# Altium schematic sheet SOM.SchDoc
size A3
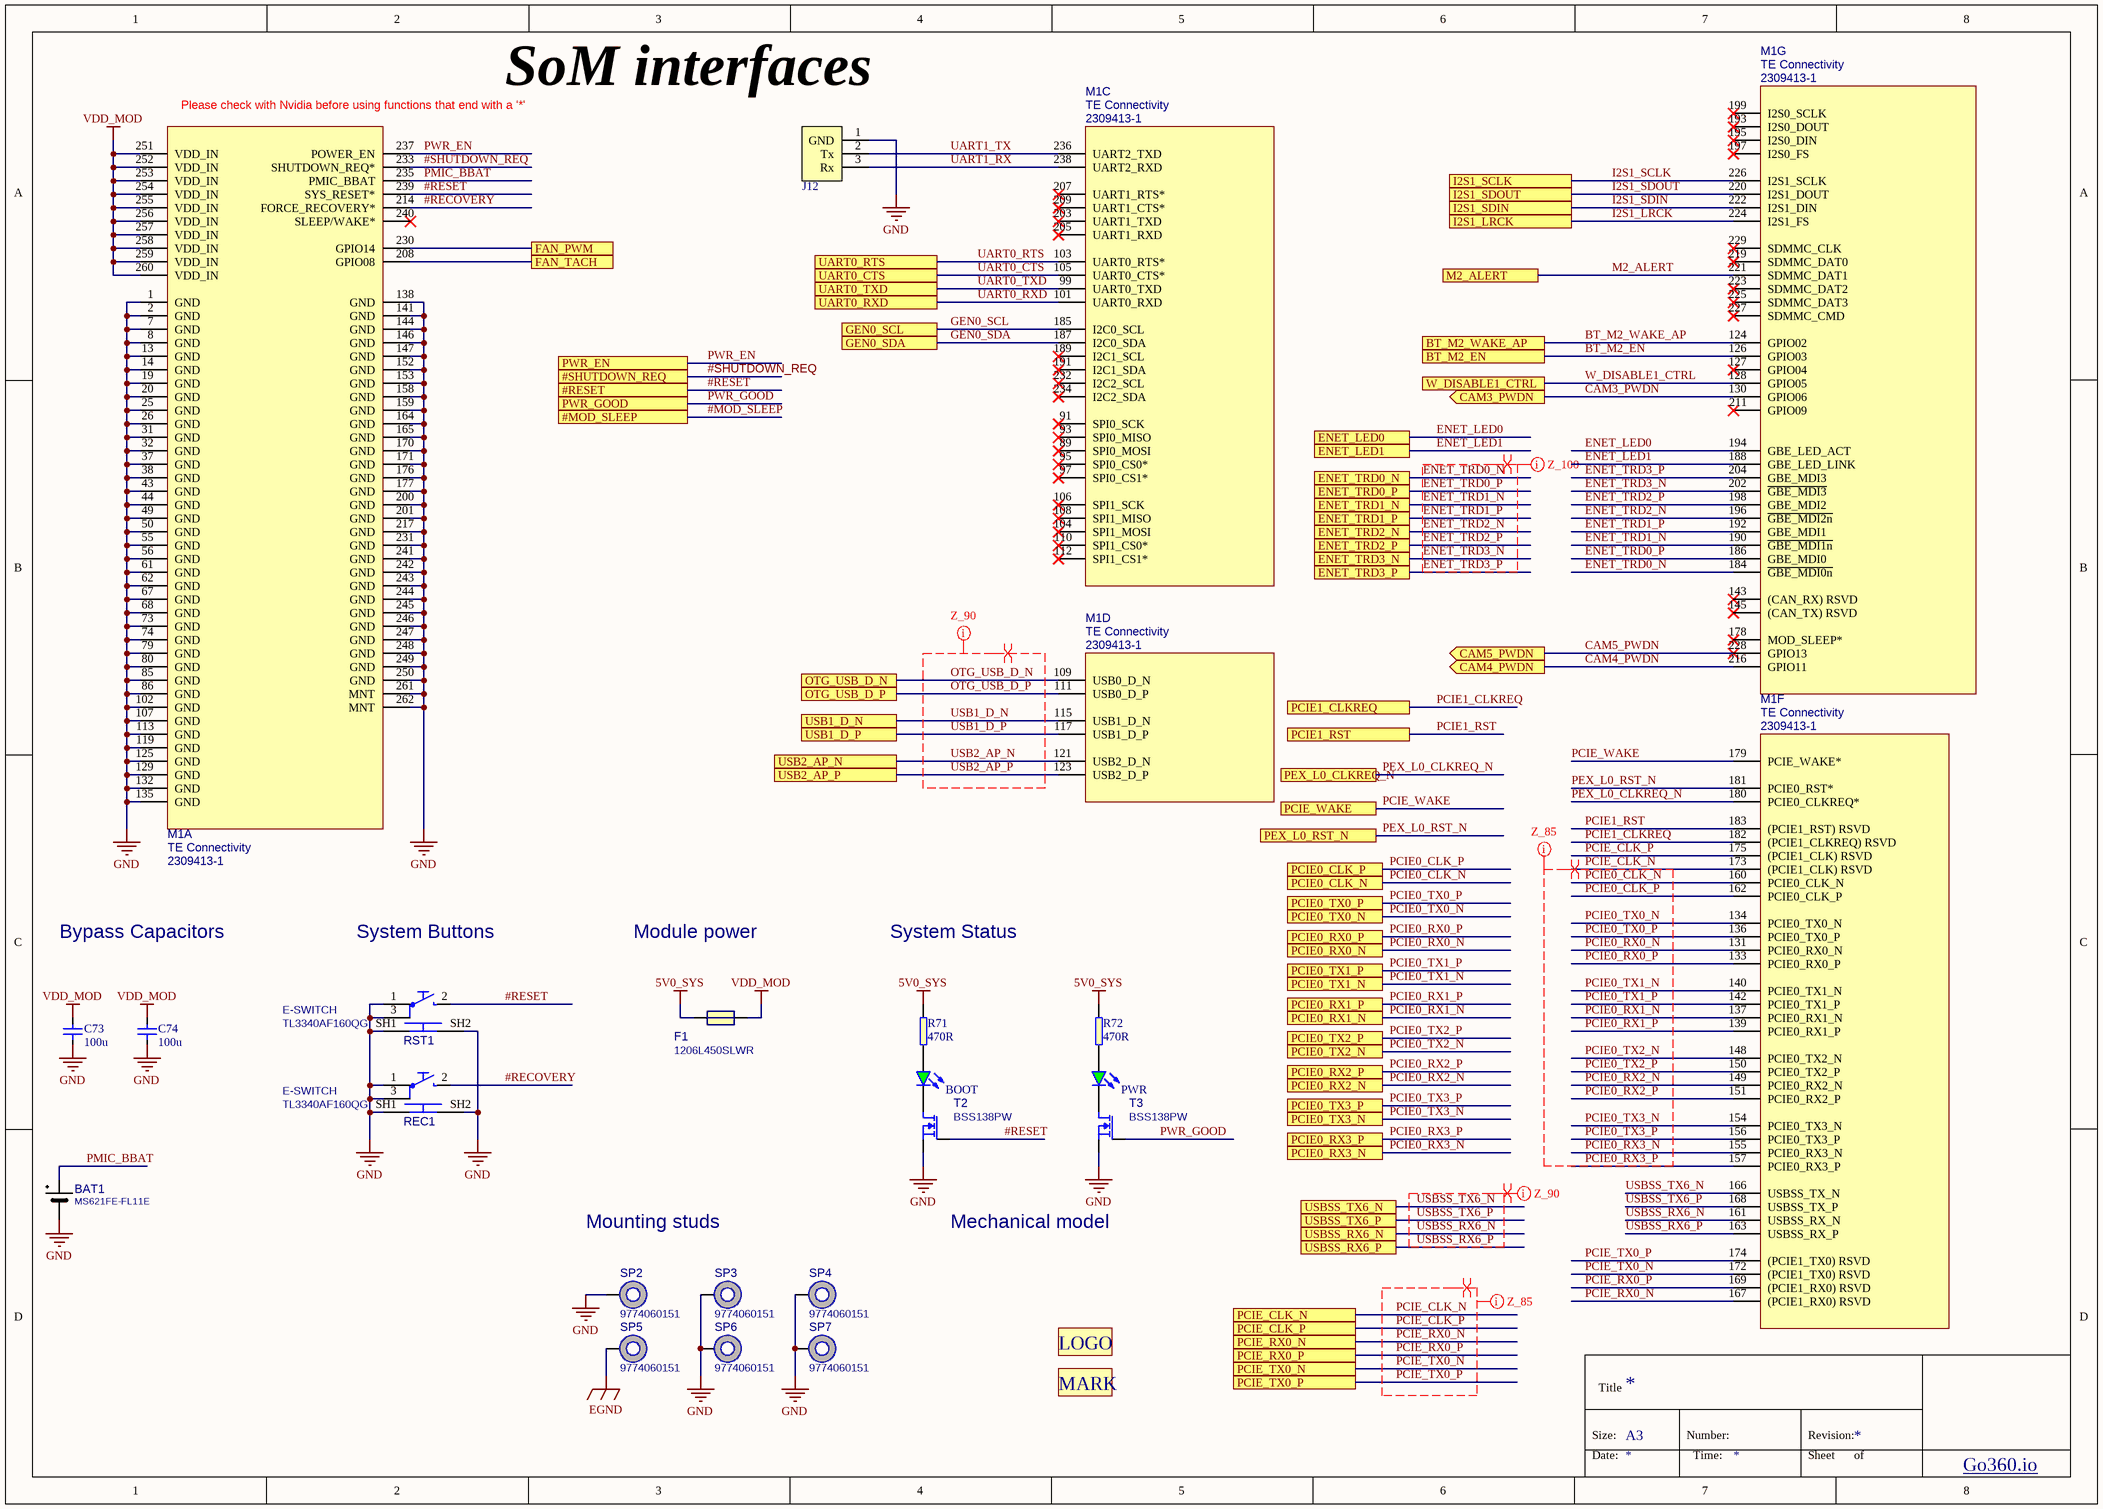
[diagram p0: SOM.SchDoc]

## Parts
BAT1  MS621FE-FL11E  [MS621FE-FL11E]
BOOT  SML-310MTT86  [LED0603]  (value not drawn)
C73  100u  [1206]
C74  100u  [1206]
F1  PartSymbol: 1206L450SLWR  [Fuse-1206]  (hidden comment: Value)
J12  HEADER_3  [826936-3]  (value not drawn)
LOGO1  LOGO  [LOGO_2]  (value not drawn)
M1  Manufacturer: TE Connectivity  [jetson-nano-connector]  (hidden comment: 2309413-1)  (parts A,C,D,F,G of 7)
MARK1  MARK  [MARK]  (value not drawn)
PWR  SML-310MTT86  [LED0603]  (value not drawn)
R71  470R  [R0402]
R72  470R  [R0402]
REC1  Manufacturer: E-SWITCH  [TL3340AF160QG]  (hidden comment: TL3340AF160QG)
RST1  Manufacturer: E-SWITCH  [TL3340AF160QG]  (hidden comment: TL3340AF160QG)
SP2  9774060151  [M2.5-6mm]
SP3  9774060151  [M2.5-6mm]
SP4  9774060151  [M2.5-6mm]
SP5  9774060151  [M2.5-6mm]
SP6  9774060151  [M2.5-6mm]
SP7  9774060151  [M2.5-6mm]
T2  BSS138PW  [SC70-3]
T3  BSS138PW  [SC70-3]

## Ports
#MOD_SLEEP, #RESET, #SHUTDOWN_REQ, BT_M2_EN, BT_M2_WAKE_AP, CAM3_PWDN (out), CAM4_PWDN (out), CAM5_PWDN (out), ENET_LED0, ENET_LED1, ENET_TRD0_N, ENET_TRD0_P, ENET_TRD1_N, ENET_TRD1_P, ENET_TRD2_N, ENET_TRD2_P, ENET_TRD3_N, ENET_TRD3_P, FAN_PWM, FAN_TACH, GEN0_SCL, GEN0_SDA, I2S1_LRCK, I2S1_SCLK, I2S1_SDIN, I2S1_SDOUT, M2_ALERT, OTG_USB_D_N, OTG_USB_D_P, PCIE0_CLK_N, PCIE0_CLK_P, PCIE0_RX0_N, PCIE0_RX0_P, PCIE0_RX1_N, PCIE0_RX1_P, PCIE0_RX2_N, PCIE0_RX2_P, PCIE0_RX3_N, PCIE0_RX3_P, PCIE0_TX0_N, PCIE0_TX0_P, PCIE0_TX1_N, PCIE0_TX1_P, PCIE0_TX2_N, PCIE0_TX2_P, PCIE0_TX3_N, PCIE0_TX3_P, PCIE1_CLKREQ, PCIE1_RST, PCIE_CLK_N, PCIE_CLK_P, PCIE_RX0_N, PCIE_RX0_P, PCIE_TX0_N, PCIE_TX0_P, PCIE_WAKE, PEX_L0_CLKREQ_N, PEX_L0_RST_N, PWR_EN, PWR_GOOD, UART0_CTS, UART0_RTS, UART0_RXD, UART0_TXD, USB1_D_N, USB1_D_P, USB2_AP_N, USB2_AP_P, USBSS_RX6_N, USBSS_RX6_P, USBSS_TX6_N, USBSS_TX6_P, W_DISABLE1_CTRL

## Nets
5V0_SYS: F1.1 R71.2 R72.2
EGND: SP5.1
GND: BAT1.- C73.1 C74.1 J12.1(GND) M1.1(GND) M1.2(GND) M1.7(GND) M1.8(GND) M1.13(GND) M1.14(GND) M1.19(GND) M1.20(GND) M1.25(GND) M1.26(GND) M1.31(GND) M1.32(GND) M1.37(GND) M1.38(GND) M1.43(GND) M1.44(GND) M1.49(GND) M1.50(GND) M1.55(GND) M1.56(GND) M1.61(GND) M1.62(GND) M1.67(GND) M1.68(GND) M1.73(GND) M1.74(GND) M1.79(GND) M1.80(GND) M1.85(GND) M1.86(GND) M1.102(GND) M1.107(GND) M1.113(GND) M1.119(GND) M1.125(GND) M1.129(GND) M1.132(GND) M1.135(GND) M1.138(GND) M1.141(GND) M1.144(GND) M1.146(GND) M1.147(GND) M1.152(GND) M1.153(GND) M1.158(GND) M1.159(GND) M1.164(GND) M1.165(GND) M1.170(GND) M1.171(GND) M1.176(GND) M1.177(GND) M1.200(GND) M1.201(GND) M1.217(GND) M1.231(GND) M1.241(GND) M1.242(GND) M1.243(GND) M1.244(GND) M1.245(GND) M1.246(GND) M1.247(GND) M1.248(GND) M1.249(GND) M1.250(GND) M1.261(MNT) M1.262(MNT) REC1.1 REC1.3 REC1.SH1 REC1.SH2 RST1.1 RST1.3 RST1.SH1 RST1.SH2 SP2.1 SP3.1 SP4.1 SP6.1 SP7.1 T2.2(S) T3.2(S)
VDD_MOD: C73.2 C74.2 F1.2 M1.251(VDD_IN) M1.252(VDD_IN) M1.253(VDD_IN) M1.254(VDD_IN) M1.255(VDD_IN) M1.256(VDD_IN) M1.257(VDD_IN) M1.258(VDD_IN) M1.259(VDD_IN) M1.260(VDD_IN)
#MOD_SLEEP: port #MOD_SLEEP
#RECOVERY: M1.214(FORCE_RECOVERY*) REC1.2
#RESET: M1.239(SYS_RESET*) RST1.2 T2.1(G) ; port #RESET
#SHUTDOWN_REQ: M1.233(SHUTDOWN_REQ*) ; port #SHUTDOWN_REQ
BT_M2_EN: M1.126(GPIO03) ; port BT_M2_EN
BT_M2_WAKE_AP: M1.124(GPIO02) ; port BT_M2_WAKE_AP
CAM3_PWDN: M1.130(GPIO06) ; port CAM3_PWDN
CAM4_PWDN: M1.216(GPIO11) ; port CAM4_PWDN
CAM5_PWDN: M1.228(GPIO13) ; port CAM5_PWDN
ENET_LED0: M1.194(GBE_LED_ACT) ; port ENET_LED0
ENET_LED1: M1.188(GBE_LED_LINK) ; port ENET_LED1
ENET_TRD0_N: M1.184(~{GBE_MDI0n}) ; port ENET_TRD0_N
ENET_TRD0_P: M1.186(GBE_MDI0) ; port ENET_TRD0_P
ENET_TRD1_N: M1.190(~{GBE_MDI1n}) ; port ENET_TRD1_N
ENET_TRD1_P: M1.192(GBE_MDI1) ; port ENET_TRD1_P
ENET_TRD2_N: M1.196(~{GBE_MDI2n}) ; port ENET_TRD2_N
ENET_TRD2_P: M1.198(GBE_MDI2) ; port ENET_TRD2_P
ENET_TRD3_N: M1.202(~{GBE_MDI3}) ; port ENET_TRD3_N
ENET_TRD3_P: M1.204(GBE_MDI3) ; port ENET_TRD3_P
FAN_PWM: M1.230(GPIO14) ; port FAN_PWM
FAN_TACH: M1.208(GPIO08) ; port FAN_TACH
GEN0_SCL: M1.185(I2C0_SCL) ; port GEN0_SCL
GEN0_SDA: M1.187(I2C0_SDA) ; port GEN0_SDA
I2S1_LRCK: M1.224(I2S1_FS) ; port I2S1_LRCK
I2S1_SCLK: M1.226(I2S1_SCLK) ; port I2S1_SCLK
I2S1_SDIN: M1.222(I2S1_DIN) ; port I2S1_SDIN
I2S1_SDOUT: M1.220(I2S1_DOUT) ; port I2S1_SDOUT
M2_ALERT: M1.221(SDMMC_DAT1) ; port M2_ALERT
OTG_USB_D_N: M1.109(USB0_D_N) ; port OTG_USB_D_N
OTG_USB_D_P: M1.111(USB0_D_P) ; port OTG_USB_D_P
PCIE0_CLK_N: M1.160(PCIE0_CLK_N) ; port PCIE0_CLK_N
PCIE0_CLK_P: M1.162(PCIE0_CLK_P) ; port PCIE0_CLK_P
PCIE0_RX0_N: M1.131(PCIE0_RX0_N) ; port PCIE0_RX0_N
PCIE0_RX0_P: M1.133(PCIE0_RX0_P) ; port PCIE0_RX0_P
PCIE0_RX1_N: M1.137(PCIE0_RX1_N) ; port PCIE0_RX1_N
PCIE0_RX1_P: M1.139(PCIE0_RX1_P) ; port PCIE0_RX1_P
PCIE0_RX2_N: M1.149(PCIE0_RX2_N) ; port PCIE0_RX2_N
PCIE0_RX2_P: M1.151(PCIE0_RX2_P) ; port PCIE0_RX2_P
PCIE0_RX3_N: M1.155(PCIE0_RX3_N) ; port PCIE0_RX3_N
PCIE0_RX3_P: M1.157(PCIE0_RX3_P) ; port PCIE0_RX3_P
PCIE0_TX0_N: M1.134(PCIE0_TX0_N) ; port PCIE0_TX0_N
PCIE0_TX0_P: M1.136(PCIE0_TX0_P) ; port PCIE0_TX0_P
PCIE0_TX1_N: M1.140(PCIE0_TX1_N) ; port PCIE0_TX1_N
PCIE0_TX1_P: M1.142(PCIE0_TX1_P) ; port PCIE0_TX1_P
PCIE0_TX2_N: M1.148(PCIE0_TX2_N) ; port PCIE0_TX2_N
PCIE0_TX2_P: M1.150(PCIE0_TX2_P) ; port PCIE0_TX2_P
PCIE0_TX3_N: M1.154(PCIE0_TX3_N) ; port PCIE0_TX3_N
PCIE0_TX3_P: M1.156(PCIE0_TX3_P) ; port PCIE0_TX3_P
PCIE1_CLKREQ: M1.182((PCIE1_CLKREQ)_RSVD) ; port PCIE1_CLKREQ
PCIE1_RST: M1.183((PCIE1_RST)_RSVD) ; port PCIE1_RST
PCIE_CLK_N: M1.173((PCIE1_CLK)_RSVD) ; port PCIE_CLK_N
PCIE_CLK_P: M1.175((PCIE1_CLK)_RSVD) ; port PCIE_CLK_P
PCIE_RX0_N: M1.167((PCIE1_RX0)_RSVD) ; port PCIE_RX0_N
PCIE_RX0_P: M1.169((PCIE1_RX0)_RSVD) ; port PCIE_RX0_P
PCIE_TX0_N: M1.172((PCIE1_TX0)_RSVD) ; port PCIE_TX0_N
PCIE_TX0_P: M1.174((PCIE1_TX0)_RSVD) ; port PCIE_TX0_P
PCIE_WAKE: M1.179(PCIE_WAKE*) ; port PCIE_WAKE
PEX_L0_CLKREQ_N: M1.180(PCIE0_CLKREQ*) ; port PEX_L0_CLKREQ_N
PEX_L0_RST_N: M1.181(PCIE0_RST*) ; port PEX_L0_RST_N
PMIC_BBAT: BAT1.+ M1.235(PMIC_BBAT)
PWR_EN: M1.237(POWER_EN) ; port PWR_EN
PWR_GOOD: T3.1(G) ; port PWR_GOOD
UART0_CTS: M1.105(UART0_CTS*) ; port UART0_CTS
UART0_RTS: M1.103(UART0_RTS*) ; port UART0_RTS
UART0_RXD: M1.101(UART0_RXD) ; port UART0_RXD
UART0_TXD: M1.99(UART0_TXD) ; port UART0_TXD
UART1_RX: J12.3(Rx) M1.238(UART2_RXD)
UART1_TX: J12.2(Tx) M1.236(UART2_TXD)
USB1_D_N: M1.115(USB1_D_N) ; port USB1_D_N
USB1_D_P: M1.117(USB1_D_P) ; port USB1_D_P
USB2_AP_N: M1.121(USB2_D_N) ; port USB2_AP_N
USB2_AP_P: M1.123(USB2_D_P) ; port USB2_AP_P
USBSS_RX6_N: M1.161(USBSS_RX_N) ; port USBSS_RX6_N
USBSS_RX6_P: M1.163(USBSS_RX_P) ; port USBSS_RX6_P
USBSS_TX6_N: M1.166(USBSS_TX_N) ; port USBSS_TX6_N
USBSS_TX6_P: M1.168(USBSS_TX_P) ; port USBSS_TX6_P
W_DISABLE1_CTRL: M1.128(GPIO05) ; port W_DISABLE1_CTRL
NetBOOT_A: BOOT.A R71.1
NetBOOT_K: BOOT.K T2.3(D)
NetPWR_A: PWR.A R72.1
NetPWR_K: PWR.K T3.3(D)

Not connected (* = marked no-connect by the designer): M1 89(SPI0_MOSI)* 91(SPI0_SCK)* 93(SPI0_MISO)* 95(SPI0_CS0*)* 97(SPI0_CS1*)* 104(SPI1_MOSI)* 106(SPI1_SCK)* 108(SPI1_MISO)* 110(SPI1_CS0*)* 112(SPI1_CS1*)* 127(GPIO04)* 143((CAN_RX)_RSVD)* 145((CAN_TX)_RSVD)* 178(MOD_SLEEP*)* 189(I2C1_SCL)* 191(I2C1_SDA)* 193(I2S0_DOUT)* 195(I2S0_DIN)* 197(I2S0_FS)* 199(I2S0_SCLK)* 203(UART1_TXD)* 205(UART1_RXD)* 207(UART1_RTS*)* 209(UART1_CTS*)* 211(GPIO09)* 219(SDMMC_DAT0)* 223(SDMMC_DAT2)* 225(SDMMC_DAT3)* 227(SDMMC_CMD)* 229(SDMMC_CLK)* 232(I2C2_SCL)* 234(I2C2_SDA)* 240(SLEEP/WAKE*)*

## Layout directives
differential pair: ENET_TRD0_N, ENET_TRD0_P, ENET_TRD1_N, ENET_TRD1_P, ENET_TRD2_N, ENET_TRD2_P, ENET_TRD3_N, ENET_TRD3_P, OTG_USB_D_N, OTG_USB_D_P, PCIE0_CLK_N, PCIE0_CLK_P, PCIE0_RX0_N, PCIE0_RX0_P, PCIE0_RX1_N, PCIE0_RX1_P, PCIE0_RX2_N, PCIE0_RX2_P, PCIE0_RX3_N, PCIE0_RX3_P, PCIE0_TX0_N, PCIE0_TX0_P, PCIE0_TX1_N, PCIE0_TX1_P, PCIE0_TX2_N, PCIE0_TX2_P, PCIE0_TX3_N, PCIE0_TX3_P, PCIE_CLK_N, PCIE_CLK_P, PCIE_RX0_N, PCIE_RX0_P, PCIE_TX0_N, PCIE_TX0_P, USB1_D_N, USB1_D_P, USB2_AP_N, USB2_AP_P, USBSS_RX6_N, USBSS_RX6_P, USBSS_TX6_N, USBSS_TX6_P
net class Z_90: OTG_USB_D_N, OTG_USB_D_P, USB1_D_N, USB1_D_P, USB2_AP_N, USB2_AP_P, USBSS_RX6_N, USBSS_RX6_P, USBSS_TX6_N, USBSS_TX6_P
net class Z_100: ENET_TRD0_N, ENET_TRD0_P, ENET_TRD1_N, ENET_TRD1_P, ENET_TRD2_N, ENET_TRD2_P, ENET_TRD3_N, ENET_TRD3_P
net class Z_85: PCIE0_CLK_N, PCIE0_CLK_P, PCIE0_RX0_N, PCIE0_RX0_P, PCIE0_RX1_N, PCIE0_RX1_P, PCIE0_RX2_N, PCIE0_RX2_P, PCIE0_RX3_N, PCIE0_RX3_P, PCIE0_TX0_N, PCIE0_TX0_P, PCIE0_TX1_N, PCIE0_TX1_P, PCIE0_TX2_N, PCIE0_TX2_P, PCIE0_TX3_N, PCIE0_TX3_P, PCIE_CLK_N, PCIE_CLK_P, PCIE_RX0_N, PCIE_RX0_P, PCIE_TX0_N, PCIE_TX0_P

## Notes on the sheet
- (near J12) SoM interfaces
- Bypass Capacitors
- System Buttons
- Module power
- System Status
- Mounting studs
- Mechanical model
- Title
- Size:
- Date:
- A3
- Number:
- Time:
- Revision:
- Sheet
- of
- Go360.io
- (in symbol jetson-nano-new-release, part A) Please check with Nvidia before using functions that end with a '*'

## Library data of the parts
BAT1 = battery: Rechargeable Battery, Coin Cell, Single Cell, 3 V, Lithium Manganese Dioxide, 5.5 mAh, Button Cell; Manufacturer: SEIKO INSTRUMENTS; PartNumber: MS621FE-FL11E; Value: MS621FE-FL11E; PartSymbol: MS621FE-FL11E; Class: Battery
BOOT PWR = LED: LED Green 0603 case; PartNumber: LED_G; Manufacturer: ROHM Semicon; Value: SML-310MTT86; PartSymbol: SML-310MTT86
C73 C74 = C_100u_1206: MLCC SMT Capacitor 100uF 1206; Manufacturer: Taiyo Yuden; PartSymbol: JMK316BJ107ML-T; PartNumber: C_100u_1206; Value: 100u
F1 = Fuse: PTC RESET 6V LO RHO 1206 4.50A; PartNumber: LITTELFUSE_1206L450SLWR; Manufacturer: LITTELFUSE; Value: 1206L450SLWR
M1 = jetson-nano-new-release: PartNumber: 2309413-1; PartSymbol: 2309413-1; Value: 2309413-1
R71 R72 = R_470R_0402: RES, 470R, 0402; Manufacturer: VISHAY; PartSymbol: CRCW0402470RFKED.; PartNumber: R_470R_0402; Value: 470R
REC1 RST1 = TL3340AF160QG: E-SWITCH  TL3340AF160QG  SWITCH, TACTILE SPST 50mA, SMD GULL WING; Value: TL3340AF160QG; PartNumber: TL3340AF160QG; PartSymbol: TL3340AF160QG
SP2-SP7 = SPACER: M2.5-6mm; PartNumber: M2.5x6; Manufacturer: WURTH ELEKTRONIK; Value: 9774060151; PartSymbol: 9774060151
T2 T3 = NMOS: MOSFET, N CH, 60V, 0.2A; Manufacturer: NXP; Value: BSS138PW; PartNumber: BSS138PW; PartSymbol: BSS138PW